# Altium schematic sheet Sheet1.SchDoc
size A; SheetNumber: 1; SheetTotal: 1
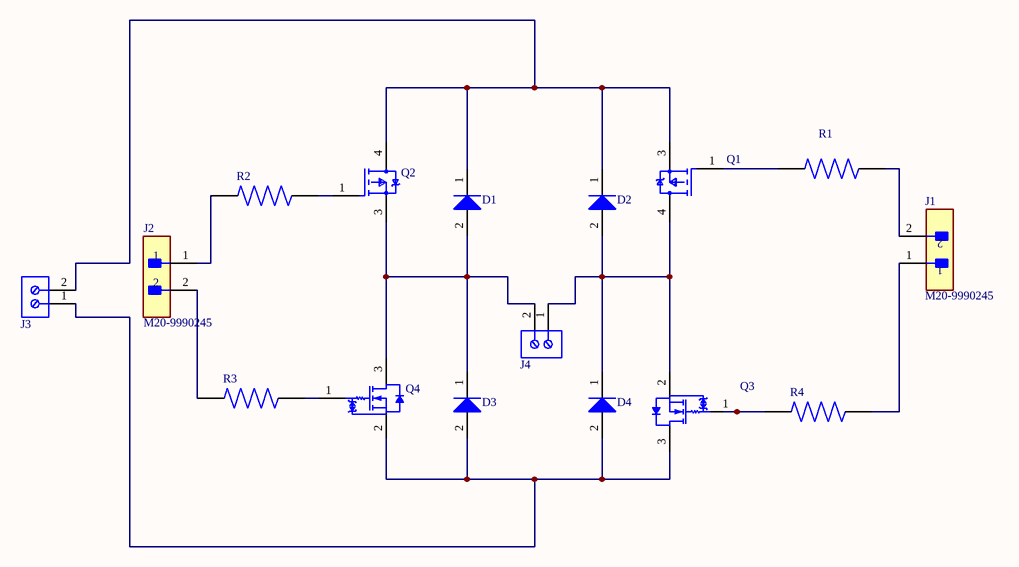
[diagram p0: Sheet1.SchDoc]

## Parts
D1  BAT54HT1G  [ONSC-SOD-323-2-477-02_V]  (value not drawn)
D2  BAT54HT1G  [ONSC-SOD-323-2-477-02_V]  (value not drawn)
D3  BAT54HT1G  [ONSC-SOD-323-2-477-02_V]  (value not drawn)
D4  BAT54HT1G  [ONSC-SOD-323-2-477-02_V]  (value not drawn)
J1  M20-9990245  [FP-M20-9990245-MFG]
J2  M20-9990245  [FP-M20-9990245-MFG]
J3  691214110002  [691214110002]  (value not drawn)
J4  691214110002  [691214110002]  (value not drawn)
Q1  NTB25P06T4G  [FP-418B-04-MFG]  (value not drawn)
Q2  NTB25P06T4G  [FP-418B-04-MFG]  (value not drawn)
Q3  2N7002WT1G  [ONSC-SC-70-3-419-04_V]  (value not drawn)
Q4  2N7002WT1G  [ONSC-SC-70-3-419-04_V]  (value not drawn)
R1  RNC55H3300BSRE6  [RESAD1081W64L635D269]  (value not drawn)
R2  RNC55H3300BSRE6  [RESAD1081W64L635D269]  (value not drawn)
R3  RNC55H3300BSRE6  [RESAD1081W64L635D269]  (value not drawn)
R4  RNC55H3300BSRE6  [RESAD1081W64L635D269]  (value not drawn)

## Nets
NetD1_1: D1.1(K) D2.1(K) J3.2 Q1.3(S) Q2.4(D)
NetD1_2: D1.2(A) D3.1(K) J4.2 Q2.3(S) Q4.3(D)
NetD2_2: D2.2(A) D4.1(K) J4.1 Q1.4(D) Q3.2(S)
NetD3_2: D3.2(A) D4.2(A) J3.1 Q3.3(D) Q4.2(S)
NetJ1_1: J1.1 R4.2
NetJ1_2: J1.2 R1.2
NetJ2_1: J2.1 R2.1
NetJ2_2: J2.2 R3.1
NetQ1_1: Q1.1(G) R1.1
NetQ2_1: Q2.1(G) R2.2
NetQ3_1: Q3.1(G) R4.1
NetQ4_1: Q4.1(G) R3.2

## Library data of the parts
D1-D4 = CMP-1055-00462-1: Schottky Barrier Diode, 2-Pin SOD-323, Pb-Free, Tape and Reel; Manufacturer: On Semiconductor; Configuration: Single; trr Max (ns): 5; IFSM Max (A): 0.6; ComponentLink3URL: http://www.onsemi.com/pub_link/Collateral/477-02.PDF.1; PackageDescription: 2-Pin SOD, Body 1.7 x 1.25 mm; ComponentLink2URL: http://www.onsemi.cn/pub_link/Collateral/BAT54HT1-D.PDF; ComponentLink3Description: Package Specification; ComponentLink2Description: Datasheet; DatasheetVersion: Rev. 6; PackageReference: SOD-323-2-477-02; RoHS: TRUE; ComponentLink1URL: http://www.onsemi.com/; Packing: Tape and Reel; PartNumber: BAT54HT1G; Mounting Technology: Surface Mount; ComponentLink1Description: Manufacturer URL; PackageVersion: Rev. H, 03/2007
J1 J2 = CMP-15831-000105-1: CONN HEADER VERT 2POS 2.54MM; Working Voltage: 750V; Gender: Male; Number of Poles: 2; Current Rating: 3A; Mated Stacking Heights: 16.54mm; Contact Resistance: 25mR; Connector Type: Male Pin; Insulation Resistance: 10GR; Mating Cycles: 300; Voltage: 50V; Flammability Rating: UL94 V-0; Pitch: 2.54mm; Series: M20; Number of Contacts: 2; Height: 0.12inch; Min Operating Temperature: -40°C; Contact Finish - Mating: GOLD; Number of Positions: 2; Number of Rows: 1; Packaging: Bulk; Package Quantity: 1000; Voltage Rating (AC): 750V; Current: 3A; Mount: Through Hole; Case/Package: SIL; Orientation: Straight; Contact Shape: Square; Weight: 0.25lb; Radiation Hardening: No; Fastening Type: Pull; Length: 5.08mm; Depth: 2.54mm; Contact Mating Length: 0.24inch; Housing Material: Nylon; Reach SVHC Compliant: Yes; Insulation Material: Nylon; Color: Black; Width: 0.25inch; Insulation Color: Black; Contact Material: Brass; Contact Type: Male Pin; Termination: Solder; Max Operating Temperature: 105°C; Contact Plating: Gold; Housing Color: Black; Max Current Rating: 3A; Lead Pitch: 2.54mm
J3 J4 = CMP-1502-02464-2: NexarPartId: 18818288; Plating: Brass, Steel; Current: 10A; Pitch: 3.5052mm; Number of Levels: 1; Number of Contacts: 2; Wire Gauge (Min): 16AWG; Voltage: 300V; Wire Gauge (Max): 24AWG; Stripping Length: -6mm; Number of Pins: 2; Number of Rows: 1; REACH SVHC: Unknown; RoHS: Compliant; Housing Material: Nylon; Termination: Screw; Mount: Through Hole; Contact Plating: Brass, Tin; Number of Positions Per Level: 2; Color: Blue, Green; Width: 7.9mm; Voltage Rating: 300V; Length: 7.4mm; Current Rating: 10A; Wire/Cable Gauge: 24AWG; Packaging: Box; Max Operating Temperature: 105°C; Lead Pitch: 3.5mm; Height: 8.7mm; Contact Material: Brass; Min Operating Temperature: -40°C
Q1 Q2 = CMP-1058-00100-2: Manufacturer Lifecycle Status: ACTIVE; NexarPartId: 341266; Turn-On Delay Time: 14ns; Number of Elements: 1; Max Junction Temperature (Tj): 175°C; Power Dissipation: 120W; Voltage Rating (DC): -60V; Gate to Source Voltage (Vgs): 15V; Drain to Source Resistance: 65mΩ; Current Rating: -25A; Turn-Off Delay Time: 43ns; Continuous Drain Current (ID): 27.5A; Rds On Max: 82mΩ; Rise Time: 72ns; Fall Time: 190ns; Input Capacitance: 1.68nF; Element Configuration: Single; Max Operating Temperature: 175°C; Length: 10.29mm; Min Operating Temperature: -55°C; RoHS: Compliant; Number of Channels: 1; Width: 9.65mm; Lifecycle Status: Production; Case/Package: D2PAK; Radiation Hardening: No; Max Power Dissipation: 120W; Schedule B: 8541290080, 8541290080; Lead Free: Lead Free; Contact Plating: Tin; Drain to Source Voltage (Vdss): -60V; Drain to Source Breakdown Voltage: -60V; Number of Pins: 3; Packaging: Digi-Reel®; Height: 4.83mm
Q3 Q4 = CMP-1058-00618-1: Small Signal MOSFET, 60 V, 340 mA, Single, N-Channel, 3-Pin SC70, Pb-Free, Tape and Reel; Manufacturer: On Semiconductor; Crss Typ (pF): 2.2; Coss Typ (pF): 4.2; VGS(th) Max (V): 2.5; Channel Polarity: N Channel; ID Max (A): 0.34; VGS Max (V): 20; V(BR)DSS Min (V): 60; Ciss Typ (pF): 24.5; Configuration: Single; Packing: Tape and Reel; Package Type: SC-70-3 / SOT-323-3; RoHS: Pb-Free; ComponentLink3Description: Package Specification; PackageReference: SC-70-3-419-04; Mounting Technology: Surface Mount; PackageVersion: Rev. N, 11/2008; ComponentLink2URL: http://www.onsemi.com/pub_link/Collateral/2N7002W-D.PDF; PartNumber: 2N7002WT1G; ComponentLink2Description: Datasheet; ComponentLink3URL: http://www.onsemi.cn/pub_link/Collateral/419-04.PDF; ComponentLink1Description: Manufacturer URL; ComponentLink1URL: http://www.onsemi.com/; DatasheetVersion: Rev. 5; PackageDescription: 3-Pin Small Outline Transistor, Body 2 x 1.25 mm, Pitch 0.65 mm
R1-R4 = RNC55H3300BSRE6: 330 Ohms Â±0.1% 0.125W, 1/8W Through Hole Resistor Axial Military, Moisture Resistant, Weldable Metal Film; MF: Vishay; SnapEDA_Link: https://www.snapeda.com/parts/RNC55H3300BSRE6/Vishay/view-part/?ref=snap; Package: erc55 Vishay; Value: *; MP: RNC55H3300BSRE6; Check_prices: https://www.snapeda.com/parts/RNC55H3300BSRE6/Vishay/view-part/?ref=eda